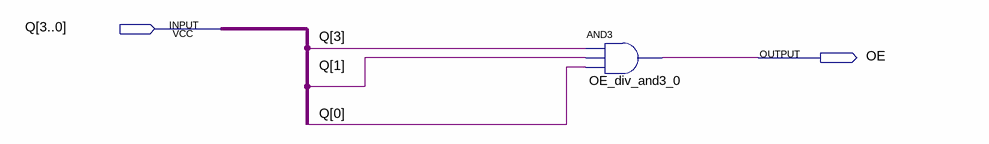
[diagram p0: schematic sheet]
// Quartus schematic OE_Division.bdf as structural Verilog: 1 symbols, 2 pins
module OE_Division (
  input  [3:0] Q,
  output OE
);

  and OE_div_and3_0 (OE, Q[3], Q[1], Q[0]);
endmodule
